# EAGLE design relay (EAGLE 8.1.1)
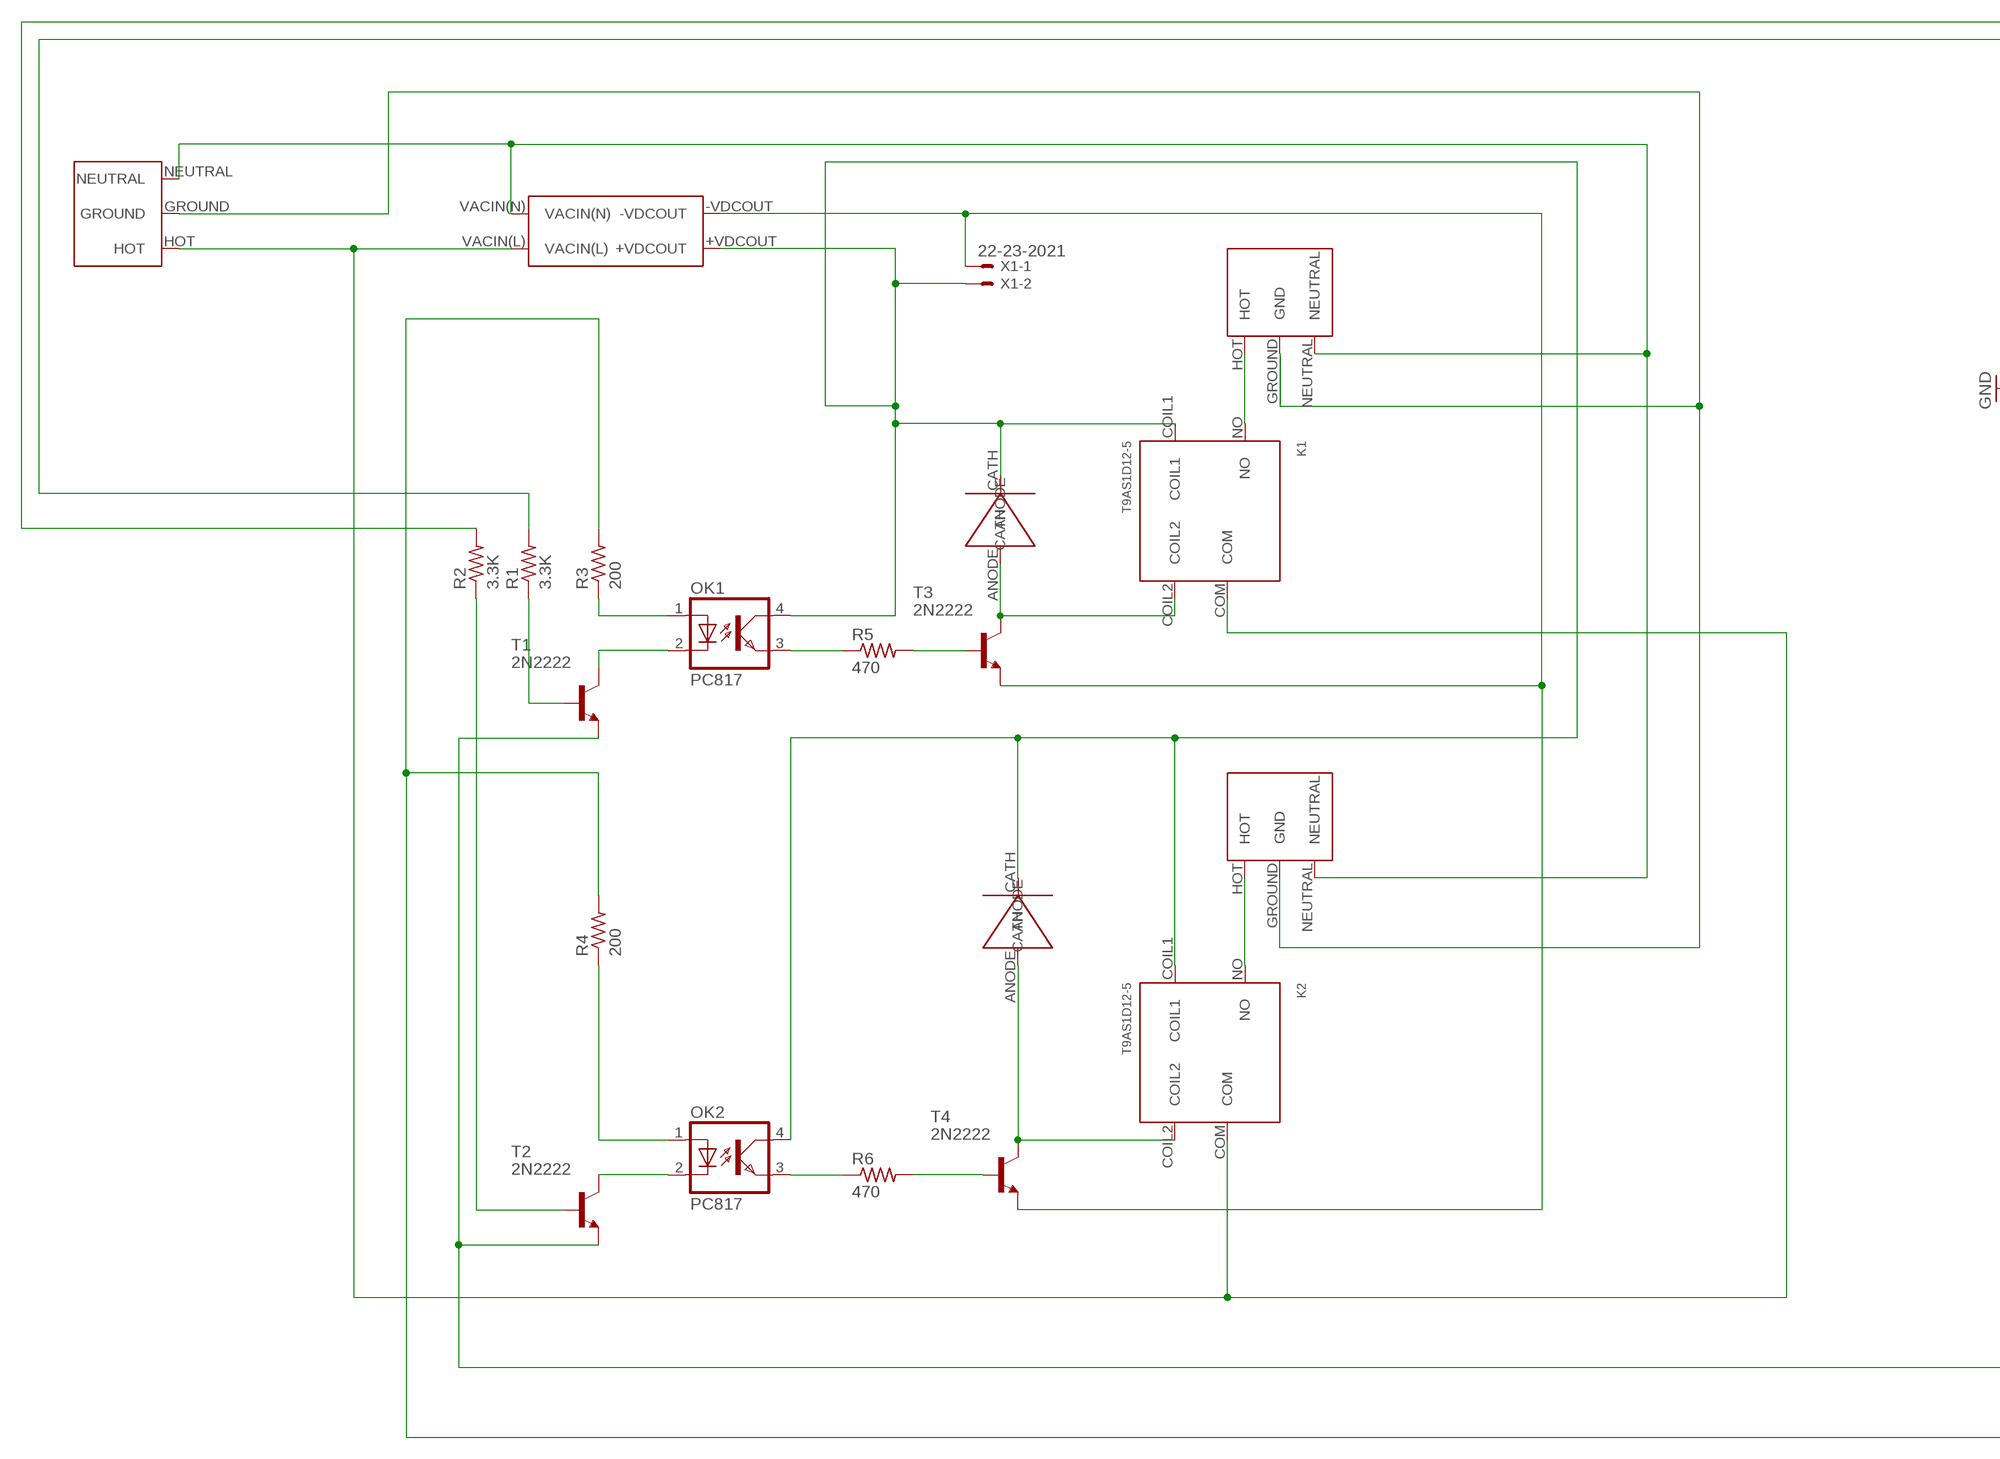
[diagram p0: schematic, sheet 1, part 1 of 2]
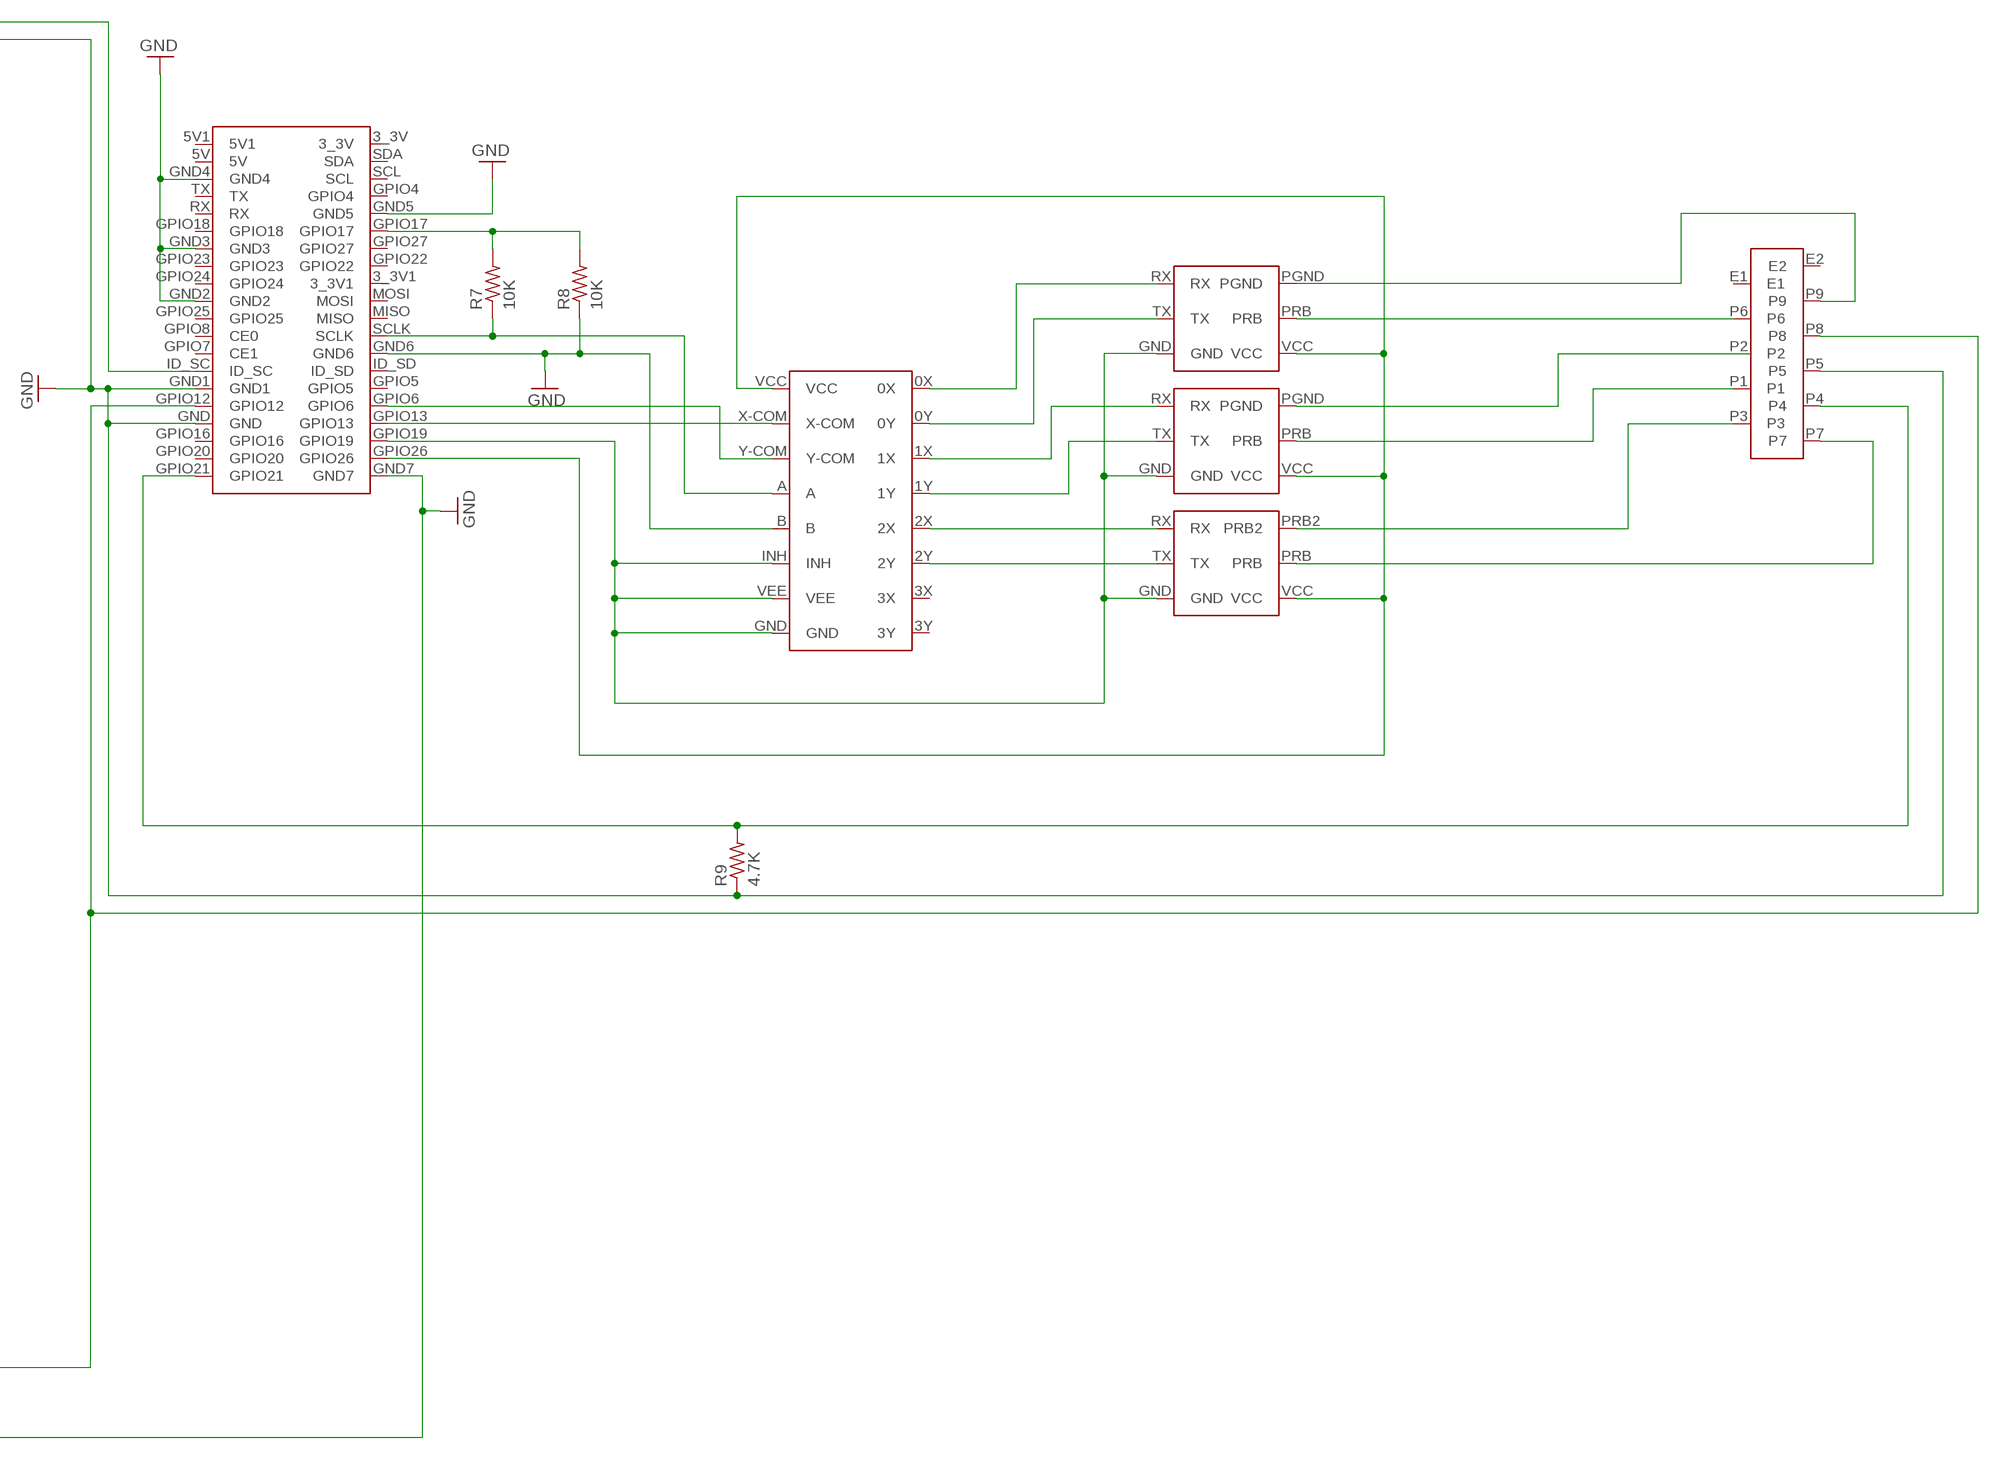
[diagram p1: schematic, sheet 1, part 2 of 2]

## Parts
K1  T9AS1D12-5  [T9AS1D12-5]
K2  T9AS1D12-5  [T9AS1D12-5]
MUX  7HC4052_MUX  [SSOP16]
OK1  PC817  [DIL04]
OK2  PC817  [DIL04]
R1  3.3K  R-US_R0805  [R0805]
R2  3.3K  R-US_R0805  [R0805]
R3  200  R-US_R0805  [R0805]
R4  200  R-US_R0805  [R0805]
R5  470  R-US_R0805  [R0805]
R6  470  R-US_R0805  [R0805]
R7  10K  R-US_R0805  [R0805]
R8  10K  R-US_R0805  [R0805]
R9  4.7K  R-US_R0805  [R0805]
T1  2N2222  [TO92-EBC-OVAL]
T2  2N2222  [TO92-EBC-OVAL]
T3  2N2222  [TO92-EBC-OVAL]
T4  2N2222  [TO92-EBC-OVAL]
U$1  PIN_20X2_NOTFLIPPED  [PIN_20X2_NOTFLIPPED]
U$2  VTB8441BH  [VTB8441BH]
U$3  VTB8441BH  [VTB8441BH]
U$4  9POS_MINI_DIN  [9POS_MINI_DIN]
U$5  ATLAS_DO_WITH_ICON  [ATLAS_DO_WITH_ICON]
U$6  IEC_FEMALE  [IEC_FEMALE]
U$7  IEC_FEMALE  [IEC_FEMALE]
U$8  ATLAS_PH_WITH_ICON  [ATLAS_PH_WITH_ICON]
U$9  ATLAS_PPM_WITH_ICON  [ATLAS_PPM_WITH_ICON]
U$12  MAIN  [MAIN]
U$17  RAC02-05SC_ACDCCONVERTER  [RAC02-05SC_ACDCCONVERTER]
X1  22-23-2021  [22-23-2021]

## Nets
AGND: T3.E T4.E U$17.-VDCOUT X1.1
DGND: T1.E T2.E U$1.GPIO12 U$4.P8
GND: MUX.B R1.2 R3.2 R4.2 R8.1 R9.1 U$1.GND U$1.GND1 U$1.GND2 U$1.GND3 U$1.GND4 U$1.GND5 U$1.GND6 U$1.GND7 U$4.P5
N$1: R2.2 U$1.ID_SC
N$3: R1.1 T1.B
N$4: OK1.1(A) R3.1
N$5: OK1.2(C) T1.C
N$7: MUX.X-COM U$1.GPIO13
N$8: R2.1 T2.B
N$9 [Power]: K1.NO U$6.HOT
N$10: OK2.1(A) R4.1
N$11: OK2.2(C) T2.C
N$12: OK2.3(EMIT) R6.1
N$13: OK1.3(EMIT) R5.1
N$14: R5.2 T3.B
N$15: R6.2 T4.B
N$16: K2.COIL2 T4.C U$3.ANODE
N$17 [Power]: K2.NO U$7.HOT
N$18: K1.COIL2 T3.C U$2.ANODE
N$19 [Power]: K1.COM K2.COM U$12.HOT U$17.VACIN(L)
N$20 [Power]: U$6.NEUTRAL U$7.NEUTRAL U$12.NEUTRAL U$17.VACIN(N)
N$21: MUX.Y-COM U$1.GPIO6
N$22: MUX.2Y U$9.TX
N$23: MUX.2X U$9.RX
N$24: MUX.1Y U$8.TX
N$25: MUX.1X U$8.RX
N$26: MUX.0Y U$5.TX
N$27: MUX.0X U$5.RX
N$29: MUX.A R7.1 U$1.SCLK
N$30: MUX.GND MUX.INH MUX.VEE U$1.GPIO19 U$5.GND U$8.GND U$9.GND
N$31: U$4.P9 U$5.PGND
N$32: K1.COIL1 K2.COIL1 OK1.4(COL) OK2.4(COL) U$2.CATH U$3.CATH U$17.+VDCOUT X1.2
N$33: MUX.VCC U$1.GPIO26 U$5.VCC U$8.VCC U$9.VCC
N$34: R7.2 R8.2 U$1.GPIO17
N$36: R9.2 U$1.GPIO21 U$4.P4
N$37: U$4.P7 U$9.PRB
N$38: U$9.PRB2
N$39: U$8.PRB
N$40: U$8.PGND
N$41: U$4.P6 U$5.PRB
PGND [Power]: U$6.GROUND(GND) U$7.GROUND(GND) U$12.GROUND
Unconnected: MUX.3X MUX.3Y U$1.GPIO4 U$1.GPIO5 U$1.GPIO7(CE1) U$1.GPIO8(CE0) U$1.GPIO16 U$1.GPIO18 U$1.GPIO20 U$1.GPIO22 U$1.GPIO23 U$1.GPIO24 U$1.GPIO25 U$1.GPIO27 U$1.ID_SD U$1.MISO U$1.MOSI U$1.RX U$1.SCL U$1.SDA U$1.TX U$4.E1 U$4.E2 U$4.P1 U$4.P2 U$4.P3

## Power pins joined to a net without a drawn wire
3_3V: U$1.3_3V
3_3V1: U$1.3_3V1
5V: U$1.5V
5V1: U$1.5V1

## Library data of the parts
K1 K2 = BloomWall:T9AS1D12-5: T9AS1D12-5 - Power Relay Technical Specifications: Coil Current: 200 mA Coil Voltage: 5VDC Switching Voltage: 277 VAC Contact Rating (Current): 30 A Coil Resistance: 25 Ohms Digikey: PB1014-ND
MUX = BloomWall:7HC4052_MUX
OK1 OK2 = optocoupler:PC817: SHARP OPTO COUPLER; MPN: PC817X4J000F; OC_FARNELL: 9707727; OC_NEWARK: 97K7059
R1-R6 = resistor:R-US_: RESISTOR, American symbol
R7-R9 = adafruit:R-US_: RESISTOR, American symbol
T1-T4 = adafruit:2N2222: NPN TRANSISTOR Big oval pads
U$1 = BloomWall:PIN_20X2_NOTFLIPPED
U$2 U$3 = BloomWall:VTB8441BH
U$4 = BloomWall:9POS_MINI_DIN
U$5 = BloomWall:ATLAS_DO_WITH_ICON
U$6 U$7 = BloomWall:IEC_FEMALE
U$8 = BloomWall:ATLAS_PH_WITH_ICON
U$9 = BloomWall:ATLAS_PPM_WITH_ICON
U$12 = BloomWall:MAIN
U$17 = BloomWall:RAC02-05SC_ACDCCONVERTER
X1 = con-molex:22-23-2021: .100" (2.54mm) Center Header - 2 Pin; MF: MOLEX; MPN: 22-23-2021; OC_FARNELL: 1462926; OC_NEWARK: 25C3832

## Net classes
0 default: width 0.305 mm, drill 0.508 mm, clearance 0.254 mm
1 Power: width 5.715 mm, drill 5.715 mm, clearance 0.508 mm

## Board
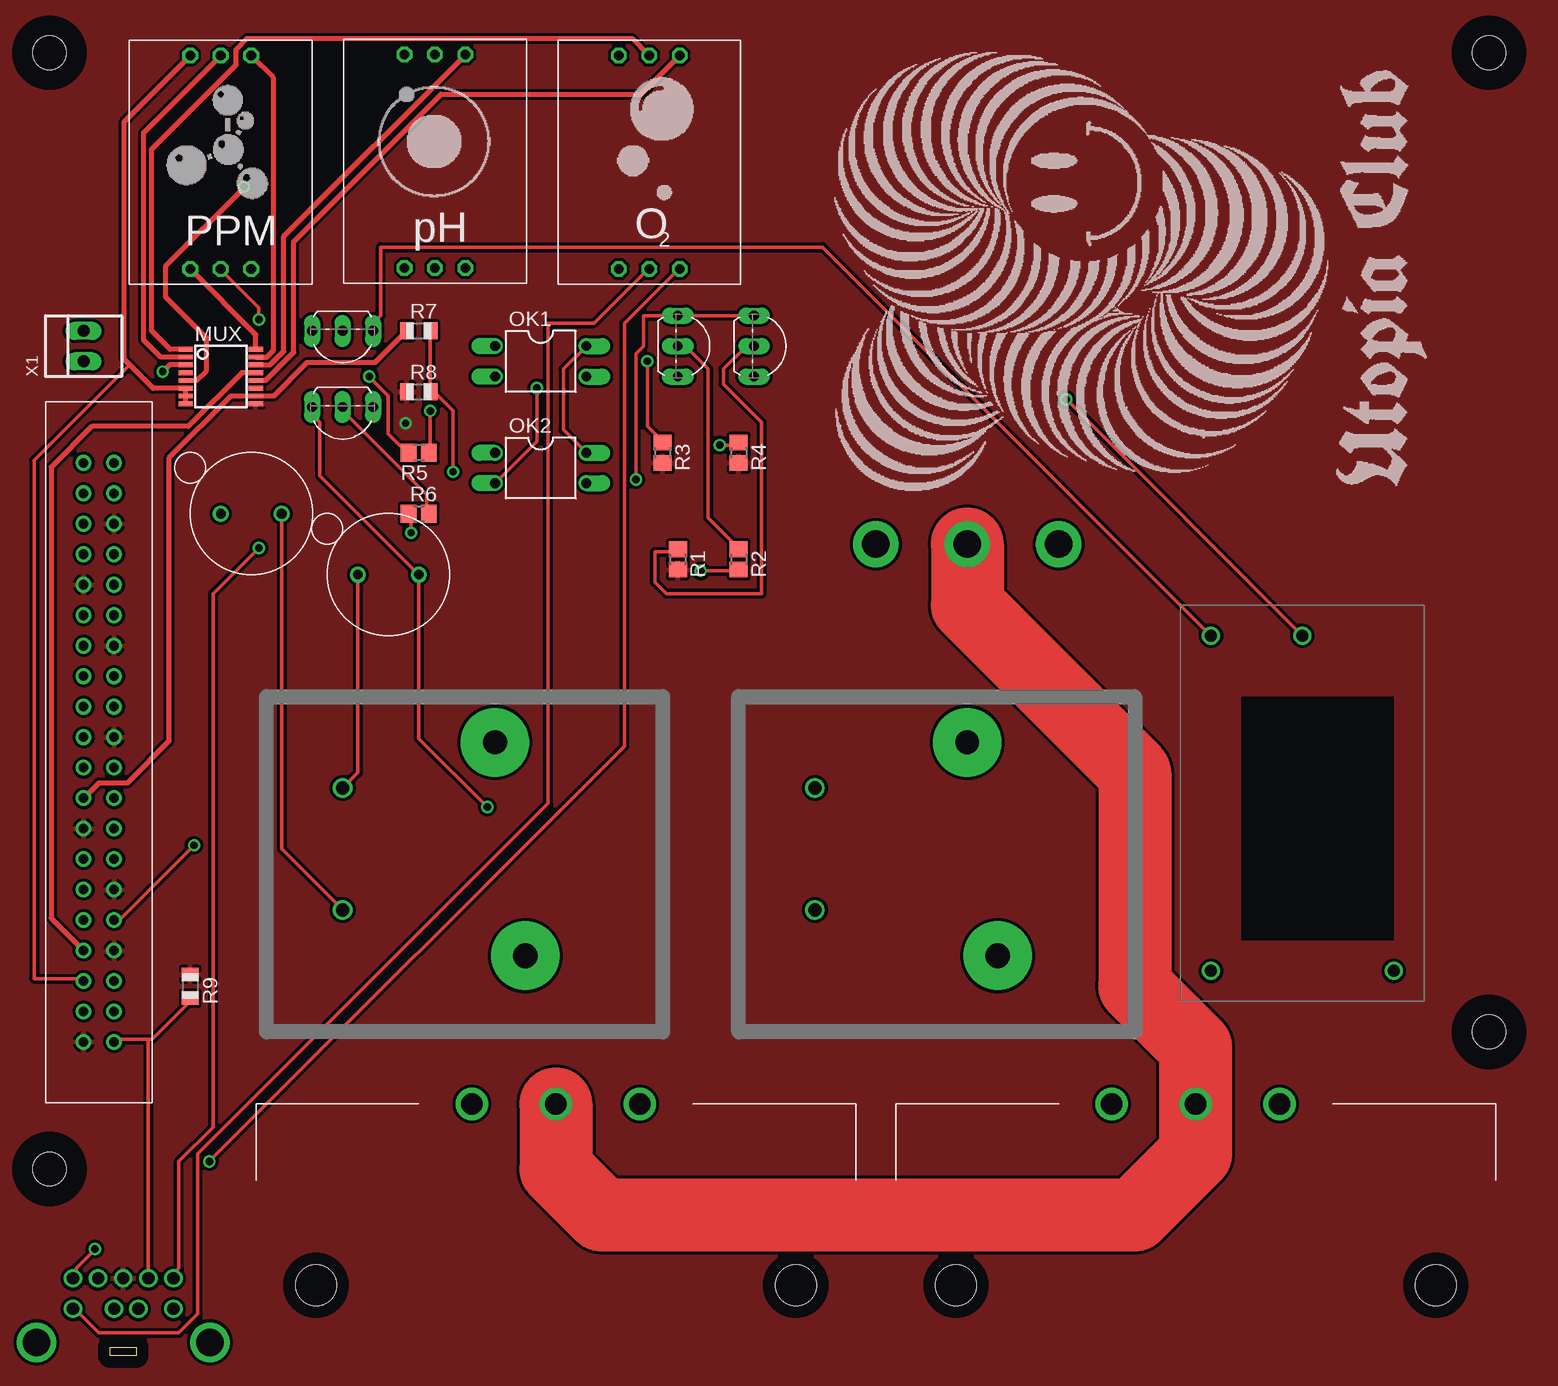
[diagram p2: board, top side]
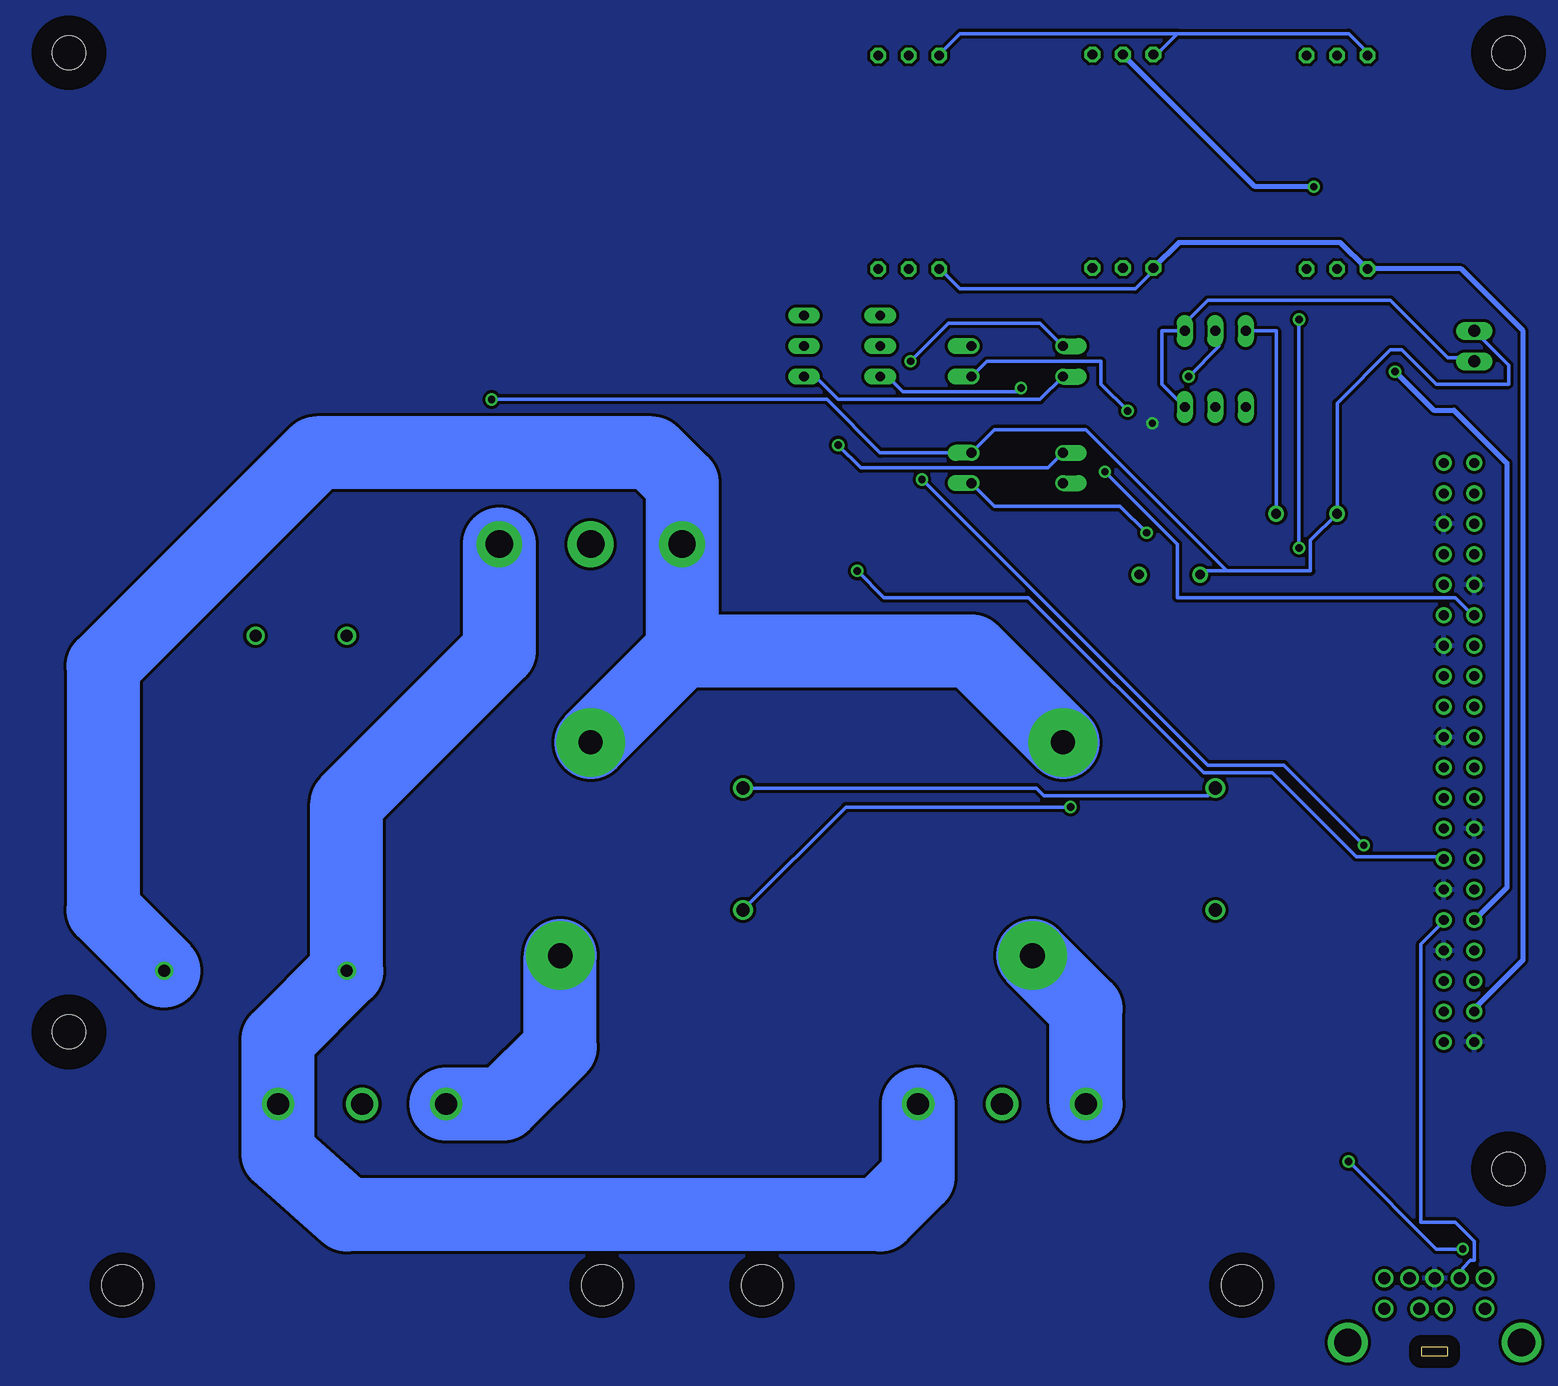
[diagram p3: board, bottom side, seen from below]

Size 2.2 x 0.7 mm. Coordinates in mm from the lower left corner, seen from the top.
Copper layers (1*16): Top 0.035mm / dielectric 1.5mm / Bottom 0.035mm
Design rules "default": minimum track width 10mil, minimum drill 24mil, track to track 8mil, track to pad 8mil, pad to pad 8mil, via to via 8mil, smd to smd 8mil, copper to edge 40mil, drill to drill 8mil, minimum pad ring 10mil, minimum via ring 8mil, stop-mask expansion 4mil, vias tented up to drill 0mil, thermal gap 10mil
Holes 2.8 mm at -5.05,108.57 114.95,108.57 114.95,26.98 -5.05,15.55
tRestrict: area 113.4,25.4 to 116.5,28.5; area 113.4,107 to 116.5,110.1; area -6.6,107 to -3.5,110.1; area -6.6,14 to -3.5,17.1
bRestrict: area -6.6,107 to -3.5,110.1; area 113.4,107 to 116.5,110.1; area 113.4,25.4 to 116.5,28.5; area -6.6,14 to -3.5,17.1

### Footprints (pad centres in the part's own frame; a part is rotated, then mirrored left to right if it is on the bottom)
T9AS1D12-5 = drill 1.092: COIL1 -13.97,-22.86; COIL2 -3.81,-22.86 | drill 1.981 pad 5.715: COM -17.78,-10.16 | drill 2.057 pad 5.715: NO 0,-7.62
SSOP16 = smd 0.4 x 1.2: 0X 0.325,2.925; 0Y -2.275,-2.925; 1X -0.975,2.925; 1Y 0.325,-2.925; 2X -1.625,2.925; 2Y -1.625,-2.925; 3X 0.975,2.925; 3Y -0.325,-2.925; A 1.625,2.925; B 2.275,2.925; GND 2.275,-2.925; INH 0.975,-2.925; VCC -2.275,2.925; VEE 1.625,-2.925; X-COM -0.325,2.925; Y-COM -0.975,-2.925
DIL04 = drill 0.813 offset: 1 -1.27,-3.81; 2 1.27,-3.81; 3 1.27,3.81; 4 -1.27,3.81
R0805 = smd 1.3 x 1.5: 1 -0.85,0; 2 0.85,0
R0805' = smd 1.1 x 1.4: 1 -1,0; 2 1,0
TO92-EBC-OVAL = drill 0.813 long: B 0,-1.27; C 2.54,-1.27; E -2.54,-1.27
PIN_20X2_NOTFLIPPED = drill 0.8: 3_3V -1.27,48.26; 3_3V1 -1.27,27.94; 5V 1.27,45.72; 5V1 1.27,48.26; GND 1.27,7.62; GND1 1.27,12.7; GND2 1.27,25.4; GND3 1.27,33.02; GND4 1.27,43.18; GND5 -1.27,38.1; GND6 -1.27,17.78; GND7 -1.27,0; GPIO4 -1.27,40.64; GPIO5 -1.27,12.7; GPIO6 -1.27,10.16; GPIO7 1.27,17.78; GPIO8 1.27,20.32; GPIO12 1.27,10.16; GPIO13 -1.27,7.62; GPIO16 1.27,5.08; GPIO17 -1.27,35.56; GPIO18 1.27,35.56; GPIO19 -1.27,5.08; GPIO20 1.27,2.54; GPIO21 1.27,0; GPIO22 -1.27,30.48; GPIO23 1.27,30.48; GPIO24 1.27,27.94; GPIO25 1.27,22.86; GPIO26 -1.27,2.54; GPIO27 -1.27,33.02; ID_SC 1.27,15.24; ID_SD -1.27,15.24; MISO -1.27,22.86; MOSI -1.27,25.4; RX 1.27,38.1; SCL -1.27,43.18; SCLK -1.27,20.32; SDA -1.27,45.72; TX 1.27,40.64
VTB8441BH = drill 0.8: ANODE 2.54,0; CATH -2.54,0
9POS_MINI_DIN = drill 2.286: E1 -7.239,-5.588; E2 7.239,-5.588 | drill 1.016: P1 -1.27,-8.382; P2 0.762,-8.382; P3 -4.191,-8.382; P4 -2.095,-10.922; P5 0,-10.922; P6 4.191,-8.382; P7 -4.191,-10.922; P8 2.095,-10.922; P9 4.191,-10.922
ATLAS_DO_WITH_ICON = drill 0.8 octagon: GND -2.54,8.89; PGND 2.54,-8.89; PRB 0,-8.89; RX 2.54,8.89; TX 0,8.89; VCC -2.54,-8.89
IEC_FEMALE = drill 1.803: GROUND 0,0; HOT -7,0; NEUTRAL 7,0 | hole 3.404: -20,-15.1; 20,-15.1
ATLAS_PH_WITH_ICON = drill 0.8 octagon: GND -2.54,8.89; PGND 2.54,-8.89; PRB 0,-8.89; RX 2.54,8.89; TX 0,8.89; VCC -2.54,-8.89
ATLAS_PPM_WITH_ICON = drill 0.8 octagon: GND -2.54,8.89; PRB 0,-8.89; PRB2 2.54,-8.89; RX 2.54,8.89; TX 0,8.89; VCC -2.54,-8.89
MAIN = drill 2.286 pad 3.81: GROUND 0,0; HOT -7.62,0; NEUTRAL 7.62,0
RAC02-05SC_ACDCCONVERTER = drill 1: +VDCOUT 0,0; -VDCOUT 0,7.62; VACIN(L) -27.94,-7.62; VACIN(N) -27.94,7.62
22-23-2021 = drill 1 long: 1 -1.27,0; 2 1.27,0

### Placement (x,y rotation side)
K1  42.25,33.33 270 top  (outside the outline)
K2  81.62,33.33 270 top  (outside the outline)
MUX  9.23,81.59 270 top  (outside the outline)
OK1  35.9,82.86 270 top  (outside the outline)
OK2  35.9,73.97 270 top  (outside the outline)
R1  47.33,66.35 270 top  (outside the outline)
R2  52.41,66.35 270 top  (outside the outline)
R3  46.06,75.24 270 top  (outside the outline)
R4  52.41,75.24 270 top  (outside the outline)
R5  25.74,75.24 180 top  (outside the outline)
R6  25.74,70.16 0 top  (outside the outline)
R7  10K  [R0805']  25.74,85.4 0 top  (outside the outline)
R8  10K  [R0805']  25.74,80.32 0 top  (outside the outline)
R9  4.7K  [R0805']  6.69,30.79 270 top  (outside the outline)
T1  54.95,84.13 270 top  (outside the outline)
T2  48.6,84.13 270 top  (outside the outline)
T3  19.39,84.13 180 top  (outside the outline)
T4  19.39,77.78 180 top  (outside the outline)
U$1  -0.93,26.14 0 top  (outside the outline)
U$2  11.77,70.16 0 top  (outside the outline)
U$3  23.2,65.08 0 top  (outside the outline)
U$4  1.1,-4.48 180 top
U$5  44.95,99.45 0 top  (outside the outline)
U$6  37.17,20.97 0 top  (outside the outline)
U$7  90.51,20.97 0 top  (outside the outline)
U$8  27.09,99.53 0 top  (outside the outline)
U$9  9.23,99.45 0 top  (outside the outline)
U$12  71.46,67.62 0 top  (outside the outline)
U$17  99.4,60 90 top  (outside the outline)
X1  -2.2,84.13 90 top  (outside the outline)

### Tracks (layer width: path | path; a pad name or v marks a point on that pad's centre or on a via)
AGND
  Top 0.305: U$17.-VDCOUT 59.39,92.39 22.56,92.39 22.56,86.67 21.93,86.04 T3.E
  Bottom 0.305: T4.E 23.83,80.96 23.83,85.4 22.56,85.4 | X1.1 -1.88,83.18 0.02,83.18 4.78,87.94 20.02,87.94 22.56,85.4 | 22.56,85.4 T3.E
DGND  (via drill 0.61)
  Top 0.305: T1.E T2.E 44.47,86.67 44.47,84.13 43.84,83.5 v43.84,73.02 | v7.01,42.54 0.97,36.51 0.34,36.51 U$1.GPIO12
  Bottom 0.305: U$1.GPIO12 0.34,36.19 2.24,34.29 2.24,11.11 -0.61,11.11 -2.2,9.52 -2.2,7.93 -1.88,7.93 -1.25,7.3 -1.25,6.66 U$4.P8 | v43.84,73.02 20.02,49.21 13.67,49.21 v7.01,42.54
GND  (via drill 0.6)
  other vias: 24.63,77.69
  pour Top: -11.26,114.69 121.65,114.69 121.65,-6.12 -11.26,-6.12
  pour Bottom: -12.36,115.87 123.68,115.87 123.68,-7.47 -12.36,-7.47
N$1  (via drill 0.61)
  Top 0.305: v49.23,65.4 52.41,65.4 R2.2
  Bottom 0.305: v49.23,65.4 47.01,63.18 34.95,63.18 20.34,48.57 14.62,48.57 7.64,41.59 0.34,41.59 U$1.ID_SC
N$3
  Top 0.305: T1.B 53.04,84.13 51.14,82.23 51.14,80.96 54.31,77.78 54.31,63.5 46.38,63.5 45.42,64.45 45.42,66.99 47.33,66.99 R1.1
N$4  (via drill 0.61)
  Top 0.305: v44.79,82.86 44.79,77.47 46.06,76.2 R3.1
  Bottom 0.305: v44.79,82.86 41.61,86.04 33.99,86.04 OK1.1
N$5
  Bottom 0.305: OK1.2 33.99,79.69 50.82,79.69 52.73,81.59 T1.C
N$7
  Top 0.406: MUX.X-COM 11,81.92 6.52,77.44 -1.52,77.44 -4.91,74.05 -4.91,36.47 U$1.GPIO13
N$8
  Top 0.305: 52.36,67.2 R2.1 52.41,67.31 49.87,69.85 49.87,82.23 47.96,84.13 T2.B
N$9
  Bottom 6.096: U$6.HOT 30.17,28.87 K1.NO
N$10  (via drill 0.61)
  Top 0.305: v50.82,75.88 52.41,75.88 R4.1
  Bottom 0.305: v50.82,75.88 48.92,73.97 33.36,73.97 OK2.1
N$11  (via drill 0.61)
  Top 0.305: OK2.2 35.58,76.2 v35.58,80.64
  Bottom 0.305: v35.58,80.64 35.9,80.32 45.42,80.32 46.69,81.59 T2.C
N$12  (via drill 0.61)
  Top 0.305: 24.98,69.72 24.98,70.14 R6.1 25.1,69.85 v25.1,68.58
  Bottom 0.305: v25.1,68.58 27.33,70.8 37.8,70.8 OK2.3
N$13  (via drill 0.61)
  Top 0.305: 26.65,75.31 R5.1 26.69,75.24 v26.69,78.74
  Bottom 0.305: v26.69,78.74 28.91,80.96 28.91,82.86 38.44,82.86 OK1.3
N$14  (via drill 0.61)
  Top 0.305: v21.61,81.59 23.2,80.01 23.2,76.83 24.79,75.24 R5.2
  Bottom 0.305: v21.61,81.59 19.07,84.13 19.07,85.4 T3.B
N$15
  Top 0.305: 26.51,70.28 R6.2 26.37,70.16 26.37,71.75 19.39,78.74 T4.B
N$16  (via drill 0.61)
  Top 0.305: T4.C 16.85,78.42 17.48,77.78 17.48,73.34 U$3.ANODE 25.74,51.43 v31.45,45.72
  Bottom 0.305: K2.COIL2 50.19,45.72 v31.45,45.72
N$17
  Bottom 6.096: U$7.HOT 78.74,20.97 74,25.71 K2.NO
N$18
  Top 0.305: K1.COIL2 14.31,42.22 U$2.ANODE
  Bottom 0.305: U$2.ANODE 14.31,85.4 T3.C
N$19
  Bottom 6.096: U$17.VACIN(L) 112.1,37.14 112.1,57.46 94.32,75.24 66.38,75.24 63.84,72.7 U$12.HOT 63.84,58.73 | 63.84,58.73 K2.COM | 63.84,58.73 39.71,58.73 K1.COM
N$20
  Bottom 6.096: U$12.NEUTRAL 79.08,58.73 91.78,46.03 U$17.VACIN(N) 97.51,26.33 U$7.NEUTRAL 97.51,16.82 91.78,11.74 47.33,11.74 44.17,14.9 U$6.NEUTRAL
N$21  (via drill 0.6)
  Top 0.406: MUX.Y-COM 4.96,82.57 v4.4,82.01
  Bottom 0.406: v4.4,82.01 | v4.4,82.01 1.18,78.79 -0.51,78.79 -4.91,74.39 -4.91,39.01 U$1.GPIO6
N$22
  Top 0.406: MUX.2Y 4.21,83.22 2.79,84.63 2.79,101.9 U$9.TX
N$23
  Top 0.406: MUX.2X 13.06,83.22 13.63,83.79 13.63,106.48 U$9.RX
N$24  (via drill 0.6)
  Top 0.406: MUX.1Y 7.22,81.27 8.04,82.09 8.04,84.8 4.66,88.19 4.66,90.81 11,97.16 11,97.25 v11.17,97.42
  Bottom 0.406: v11.17,97.42 16.08,97.42 U$8.TX
N$25
  Top 0.406: MUX.1X 13.34,82.57 14.48,83.7 14.48,93.27 U$8.RX
N$26
  Top 0.406: MUX.0Y 5,83.87 3.47,85.39 3.47,100.55 10.5,107.58 10.5,108.85 11.43,109.78 43.51,109.78 U$5.TX
N$27
  Top 0.406: MUX.0X 12.97,81.27 15.32,83.62 15.32,92.84 27.6,105.12 44.27,105.12 U$5.RX
N$29
  Top 0.406: R7.1 22.11,82.77 16.42,82.77 13.62,79.97 MUX.A 10.07,79.97 4.91,74.81 4.91,51.19 1.52,47.81 | 1.52,47.81 | 1.52,47.81 1.44,47.72 -0.94,47.72 U$1.SCLK
N$30
  Top 0.305: MUX.INH 6.37,80.64 MUX.INH | 1.63,82.57 -6.33,74.61 -6.33,31.43 -2.2,31.43 U$1.GPIO19
  Top 0.406: MUX.GND MUX.VEE MUX.INH | MUX.INH 3.59,80.62 1.63,82.57 1.18,83.03 1.18,102.84 U$9.GND
  Bottom 0.305: 22.56,110.17 8.28,110.17 6.69,108.58 U$9.GND | 22.56,110.17 24.15,108.58 24.47,108.58 U$8.GND | 22.56,110.17 40.66,110.17 42.25,108.58 U$5.GND
N$31  (via drill 0.61)
  Top 0.305: v8.28,16.19 42.88,50.8 42.88,86.04 47.33,90.48 U$5.PGND | v-1.25,8.89 -2.84,7.3 -2.84,6.66 U$4.P9
  Bottom 0.305: v8.28,16.19 0.97,8.89 v-1.25,8.89
N$32  (via drill 0.61)
  Top 0.305: OK2.4 37.8,77.15 37.8,82.23 OK1.4 | v79.71,79.69 U$17.+VDCOUT | K1.COIL1 20.66,48.57 U$3.CATH
  Bottom 0.305: v79.71,79.69 51.77,79.69 47.33,75.24 OK2.4 37.8,77.15 30.18,77.15 18.44,65.4 | 18.44,65.4 20.34,65.4 U$3.CATH | 18.44,65.4 11.45,65.4 11.45,67.94 U$2.CATH 9.23,79.37 4.78,83.82 3.83,83.82 0.97,80.96 -5.06,80.96 -5.06,82.55 X1.2 | K2.COIL1 34.31,47.3 33.67,46.67 20.02,46.67 K1.COIL1
N$33
  Top 0.406: MUX.VCC 12.15,85.09 U$9.VCC
  Bottom 0.305: U$5.VCC 42.25,90.48 40.66,88.9 26.06,88.9 24.47,90.48 U$8.VCC
  Bottom 0.406: U$1.GPIO26 -2.2,28.93 -6.27,32.99 -6.27,85.39 -1.1,90.56 U$9.VCC 6.77,90.56 8.97,92.76 22.43,92.76 U$8.VCC
N$34  (via drill 0.61)
  Top 0.305: 26.79,80.34 R8.2 | 26.79,85.37 R7.2 26.69,85.4 26.69,80.32 R8.2 | v28.6,73.66 28.6,78.74 27.01,80.32 R8.2
  Bottom 0.305: v28.6,73.66 22.56,67.62 22.56,63.18 -0.61,63.18 -1.88,61.91 -2.2,61.91 U$1.GPIO17
N$36
  Top 0.305: 6.68,29.77 R9.2 6.69,29.52 3.51,26.35 3.2,26.35 | 3.2,26.35 0.34,26.35 U$1.GPIO21 | 3.2,26.35 U$4.P4
N$37  (via drill 0.61)
  Top 0.305: v12.4,86.36 12.4,87.31 9.23,90.48 U$9.PRB | v12.4,67.31 8.59,63.5 8.59,19.05 5.74,16.19 5.74,7.3 5.42,6.98 5.42,6.66 U$4.P7
  Bottom 0.305: v12.4,67.31 v12.4,86.36
N$41
  Top 0.305: U$5.PRB 44.79,90.48 40.34,86.04 36.53,86.04 36.53,46.03 7.32,16.82 7.32,3.49 5.74,1.9 -0.93,1.9 -2.84,3.81 U$4.P6
PGND
  Top 6.096: U$12.GROUND 71.46,62.54 85.43,48.57 85.43,30.79 90.51,25.71 U$7.GROUND 90.51,16.82 85.43,11.74 40.98,11.74 37.17,15.55 U$6.GROUND